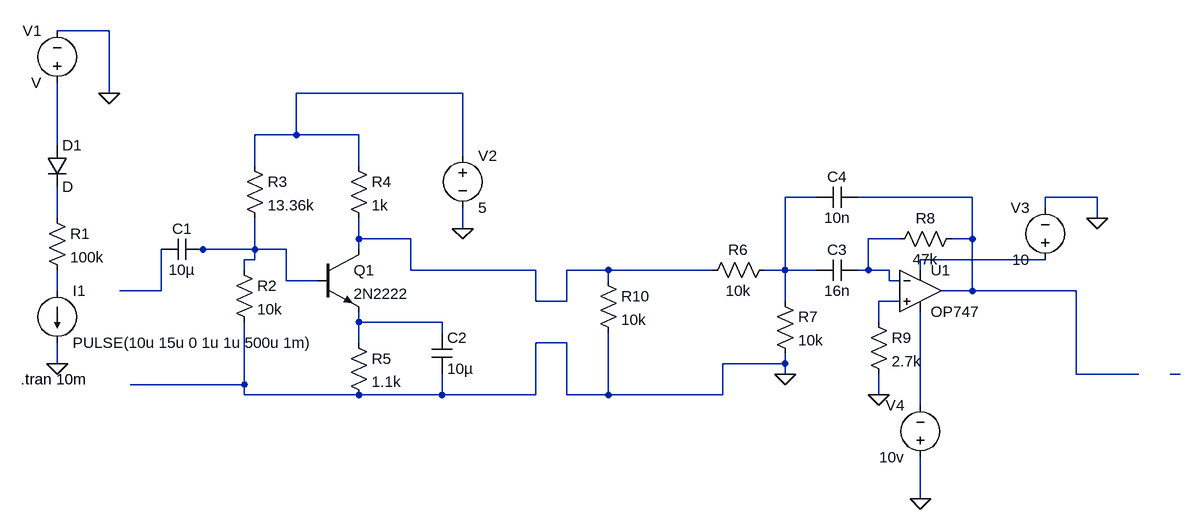
[diagram p0: schematic Draft1.asc]
Draft1.asc, the LTspice schematic file:
Version 4
SHEET 1 1812 680
WIRE 160 -272 80 -272
WIRE 160 -176 160 -272
WIRE 704 -176 448 -176
WIRE 448 -112 448 -176
WIRE 448 -112 384 -112
WIRE 544 -112 448 -112
WIRE 80 -96 80 -192
WIRE 704 -80 704 -176
WIRE 384 -64 384 -112
WIRE 544 -64 544 -112
WIRE 1248 -16 1200 -16
WIRE 1488 -16 1312 -16
WIRE 1680 -16 1600 -16
WIRE 1600 0 1600 -16
WIRE 80 16 80 -32
WIRE 1680 16 1680 -16
WIRE 704 32 704 0
WIRE 544 48 544 16
WIRE 624 48 544 48
WIRE 1376 48 1328 48
WIRE 1488 48 1488 -16
WIRE 1488 48 1456 48
WIRE 304 64 288 64
WIRE 384 64 384 16
WIRE 384 64 304 64
WIRE 432 64 384 64
WIRE 544 64 544 48
WIRE 384 80 384 64
WIRE 384 80 368 80
WIRE 1600 80 1408 80
WIRE 368 96 368 80
WIRE 624 96 624 48
WIRE 816 96 624 96
WIRE 928 96 864 96
WIRE 1088 96 928 96
WIRE 1200 96 1200 -16
WIRE 1200 96 1168 96
WIRE 1248 96 1200 96
WIRE 1328 96 1328 48
WIRE 1328 96 1312 96
WIRE 1360 96 1328 96
WIRE 1408 96 1408 80
WIRE 432 112 432 64
WIRE 480 112 432 112
WIRE 928 112 928 96
WIRE 1360 112 1360 96
WIRE 1376 112 1360 112
WIRE 80 128 80 96
WIRE 240 128 240 64
WIRE 240 128 176 128
WIRE 1488 128 1488 48
WIRE 1488 128 1440 128
WIRE 1648 128 1488 128
WIRE 816 144 816 96
WIRE 864 144 864 96
WIRE 864 144 816 144
WIRE 1200 144 1200 96
WIRE 1376 144 1344 144
WIRE 544 176 544 160
WIRE 672 176 544 176
WIRE 1344 176 1344 144
WIRE 672 192 672 176
WIRE 544 208 544 176
WIRE 864 208 816 208
WIRE 80 240 80 208
WIRE 1200 240 1200 224
WIRE 1200 240 1104 240
WIRE 1200 256 1200 240
WIRE 1648 256 1648 128
WIRE 1744 256 1648 256
WIRE 1808 256 1792 256
WIRE 368 272 368 176
WIRE 368 272 192 272
WIRE 368 288 368 272
WIRE 544 288 368 288
WIRE 672 288 672 256
WIRE 672 288 544 288
WIRE 816 288 816 208
WIRE 816 288 672 288
WIRE 864 288 864 208
WIRE 928 288 928 192
WIRE 928 288 864 288
WIRE 1104 288 1104 240
WIRE 1104 288 928 288
WIRE 1344 288 1344 256
WIRE 1408 304 1408 160
WIRE 1408 448 1408 384
FLAG 80 240 0
FLAG 704 32 0
FLAG 1200 256 0
FLAG 1344 288 0
FLAG 1680 16 0
FLAG 1408 448 0
FLAG 160 -176 0
SYMBOL current 80 128 R0
WINDOW 123 0 0 Left 0
WINDOW 39 0 0 Left 0
SYMATTR InstName I1
SYMATTR Value PULSE(10u 15u 0 1u 1u 500u 1m)
SYMBOL res 64 0 R0
SYMATTR InstName R1
SYMATTR Value 100k
SYMBOL cap 304 48 R90
WINDOW 0 0 32 VBottom 2
WINDOW 3 32 32 VTop 2
SYMATTR InstName C1
SYMATTR Value 10µ
SYMBOL res 352 80 R0
SYMATTR InstName R2
SYMATTR Value 10k
SYMBOL res 368 -80 R0
SYMATTR InstName R3
SYMATTR Value 13.36k
SYMBOL res 528 -80 R0
SYMATTR InstName R4
SYMATTR Value 1k
SYMBOL res 528 192 R0
SYMATTR InstName R5
SYMATTR Value 1.1k
SYMBOL npn 480 64 R0
SYMATTR InstName Q1
SYMATTR Value 2N2222
SYMBOL voltage 704 -96 R0
WINDOW 123 0 0 Left 0
WINDOW 39 0 0 Left 0
SYMATTR InstName V2
SYMATTR Value 5
SYMBOL cap 656 192 R0
SYMATTR InstName C2
SYMATTR Value 10µ
SYMBOL res 1184 80 R90
WINDOW 0 0 56 VBottom 2
WINDOW 3 32 56 VTop 2
SYMATTR InstName R6
SYMATTR Value 10k
SYMBOL res 1184 128 R0
SYMATTR InstName R7
SYMATTR Value 10k
SYMBOL cap 1312 80 R90
WINDOW 0 0 32 VBottom 2
WINDOW 3 32 32 VTop 2
SYMATTR InstName C3
SYMATTR Value 16n
SYMBOL cap 1312 -32 R90
WINDOW 0 0 32 VBottom 2
WINDOW 3 32 32 VTop 2
SYMATTR InstName C4
SYMATTR Value 10n
SYMBOL res 1472 32 R90
WINDOW 0 0 56 VBottom 2
WINDOW 3 32 56 VTop 2
SYMATTR InstName R8
SYMATTR Value 47k
SYMBOL OpAmps\\OP747 1408 64 R0
SYMATTR InstName U1
SYMBOL res 1328 160 R0
SYMATTR InstName R9
SYMATTR Value 2.7k
SYMBOL voltage 1600 96 R180
WINDOW 0 24 96 Left 2
WINDOW 3 24 16 Left 2
WINDOW 123 0 0 Left 0
WINDOW 39 0 0 Left 0
SYMATTR InstName V3
SYMATTR Value 10
SYMBOL voltage 1408 400 R180
WINDOW 0 24 96 Left 2
WINDOW 3 24 16 Left 2
WINDOW 123 0 0 Left 0
WINDOW 39 0 0 Left 0
SYMATTR InstName V4
SYMATTR Value 10v
SYMBOL res 912 96 R0
SYMATTR InstName R10
SYMATTR Value 10k
SYMBOL voltage 80 -176 R180
WINDOW 0 24 96 Left 2
WINDOW 3 24 16 Left 2
SYMATTR InstName V1
SYMBOL diode 64 -96 R0
SYMATTR InstName D1
TEXT 24 264 Left 2 !.tran 10m

The netlist it stands for:
* Draft1.asc
I1 N010 0 PULSE(10u 15u 0 1u 1u 500u 1m)
R1 N005 N010 100k
C1 N008 N011 10µ
R2 N008 0 10k
R3 N001 N008 13.36k
R4 N001 N006 1k
R5 N013 0 1.1k
Q1 N006 N008 N013 0 2N2222
V2 N001 0 5
C2 N013 0 10µ
R6 N003 N006 10k
R7 N003 0 10k
C3 N007 N003 16n
C4 N004 N003 10n
R8 N004 N007 47k
XU1 N012 N007 N009 N015 N004 OP747  ; pins In+ In- V+ V- OUT
R9 N012 0 2.7k
V3 N009 0 10
V4 0 N015 10v
R10 N006 0 10k
V1 N002 0 V
D1 N002 N005 D
.model D D
.lib standard.dio
.model NPN NPN
.model PNP PNP
.lib standard.bjt
.tran 10m
.backanno
.end